# Altium schematic sheet PATHOS_SOM_Ethernet.SchDoc: Ethernet to SOM
size A4; Author: A. Kalberer; CompanyName: NTB; Organization: NTB Interstate University of Applied; Address1: Werdenbergstrasse 4; Address3: 9471 Buchs; Address4: Switzerland; Organization1: Sciences of Technology Buchs; Size: A4
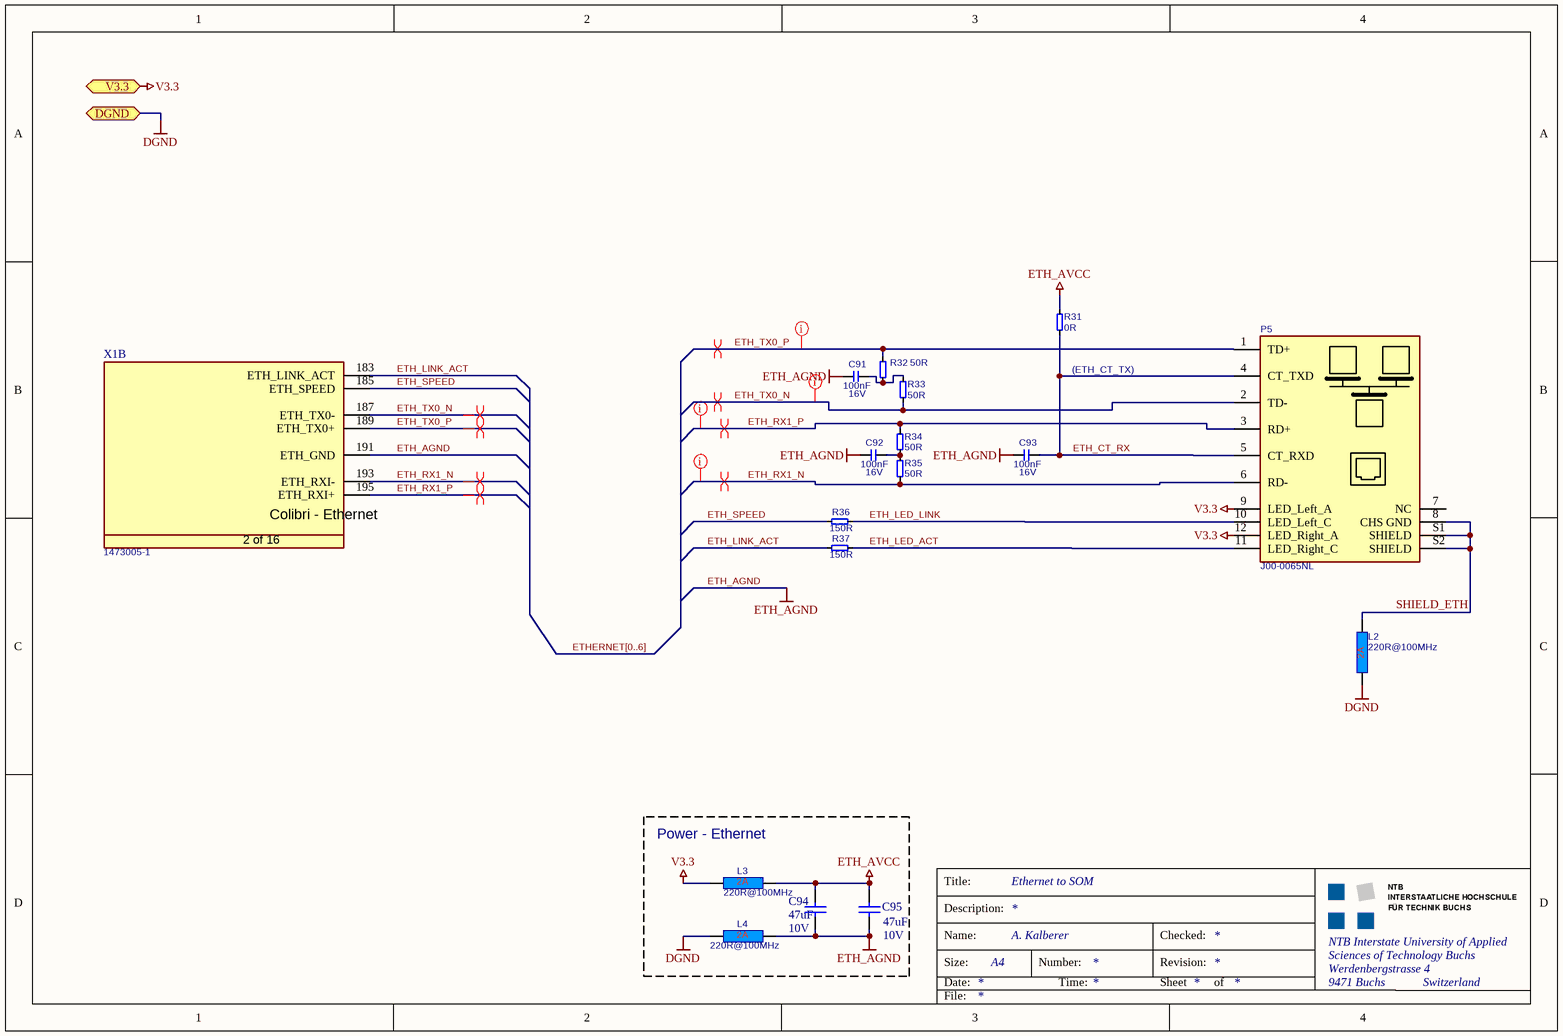
[diagram p0: PATHOS_SOM_Ethernet.SchDoc]

## Parts
C91  Rating: 16V  [0603_3D]  (hidden comment: 100nF)
C92  Rating: 16V  [0603_3D]  (hidden comment: 100nF)
C93  Rating: 16V  [0603_3D]  (hidden comment: 100nF)
C94  Voltage Maximum: 10V  [0805_3D]  (hidden comment: 47uF)
C95  Voltage Maximum: 10V  [0805_3D]  (hidden comment: 47uF)
L2  220R@100MHz  [0603_3D]
L3  220R@100MHz  [0603_3D]
L4  220R@100MHz  [0603_3D]
P5  J00-0065NL  [T_PULSE_J00-0065NL]
R31  0R  [0603_3D]
R32  50R  [0603_3D]
R33  50R  [0603_3D]
R34  50R  [0603_3D]
R35  50R  [0603_3D]
R36  150R  [0603_3D]
R37  150R  [0603_3D]
X1  Manufacturer Part No.: 1473005-1  [T_Tyco_1473005-1]  (hidden comment: CON-Tyco-1473005-1-200-0.6mm)  (part B of 16)

## Blocks framed on the sheet
Power - Ethernet: C94 C95 L3 L4

## Ports
DGND, V3.3

## Nets
DGND: L2.1 L4.1 ; port DGND
ETH_AGND: C91.1 C92.1 C93.1 C94.1 C95.1 L4.2 X1.191(ETH_GND)
ETH_AVCC: C94.2 C95.2 L3.2 R31.1
V3.3: L3.1 P5.9(LED_Left_A) P5.12(LED_Right_A) ; port V3.3
ETH_CT_RX: C93.2 P5.4(CT_TXD) P5.5(CT_RXD) R31.2
ETH_LED_ACT: P5.11(LED_Right_C) R37.2
ETH_LED_LINK: P5.10(LED_Left_C) R36.2
ETH_LINK_ACT: R37.1 X1.183(ETH_LINK_ACT)
ETH_RX1_N: P5.6(RD-) R35.1 X1.193(ETH_RXI-)
ETH_RX1_P: P5.3(RD+) R34.2 X1.195(ETH_RXI+)
ETH_SPEED: R36.1 X1.185(ETH_SPEED)
ETH_TX0_N: P5.2(TD-) R33.1 X1.187(ETH_TX0-)
ETH_TX0_P: P5.1(TD+) R32.2 X1.189(ETH_TX0+)
SHIELD_ETH: L2.2 P5.8(CHS_GND) P5.S1(SHIELD) P5.S2(SHIELD)
NetC91_2: C91.2 R32.1 R33.2
NetC92_2: C92.2 R34.1 R35.2

Not connected (* = marked no-connect by the designer): P5 7(NC)

## Buses and harness runs
bus ETHERNET[0..6]

## Layout directives
differential pair: ETH_RX1_N, ETH_RX1_P, ETH_TX0_N, ETH_TX0_P
net class ETH_TX0: ETH_TX0_N, ETH_TX0_P
net class ETH_RX1: ETH_RX1_N, ETH_RX1_P

## Notes on the sheet
- (near R31) (ETH_CT_TX)
- Title:
- Description:
- Size:
- Date:
- Name:
- Number:
- Time:
- Revision:
- Sheet
- Checked:
- of
- File:
- (in symbol CON-Tyco-1473005-1-200-0.6mm, part B) Colibri - Ethernet; 2 of 16

## Library data of the parts
C91-C93 = C-X7R-100nF-16V-10%-0603: Capacitor Ceramic X7R 100nF 16V 10% 0603; Tolerance: 10%; Type: X7R; Value: 100nF
C94 C95 = C: Capacitor; #Manufacturer: Generic Components; #Publisher: Dr. A. Heinzelmann; #Class: Passive; Initial Voltage: 0V; Type: Ceramic; #Published: 2006-10-07; #ClassSub: Capacitor; Value: 47uF
L2-L4 = L-220R@100MHz-2A-25%-0603: 220R@100MHz 2A EMI FILTER; Tolerance: 25%; Rating: 2A; Value: 220R@100MHz
P5 = CON-Pulse-J00-0065NL: RJ45 Connector; Manufacturer Name: Pulse; No. of ways: 12; Manufacturer Part No.: J00-0065NL
R31 = R-0R-100mW-JP-0603: Resistor 0 ohm 100mW Jumper 0603; Rating: 63mW; Tolerance: 1%; Value: 0R
R32-R35 = R-50R-63mW-1%-0603: Resistor 50 ohm 63mW 1% 0603; Rating: 63mW; Tolerance: 1%; Value: 50R
R36 R37 = R-150R-63mW-1%-0603: Resistor 150 ohm 63mW 1% 0603; Rating: 63mW; Tolerance: 1%; Value: 150R
X1 = CON-Tyco-1473005-1-200-0.6mm: SODIMM Connector; Manufacturer Name: Tyco; No. of ways: 200